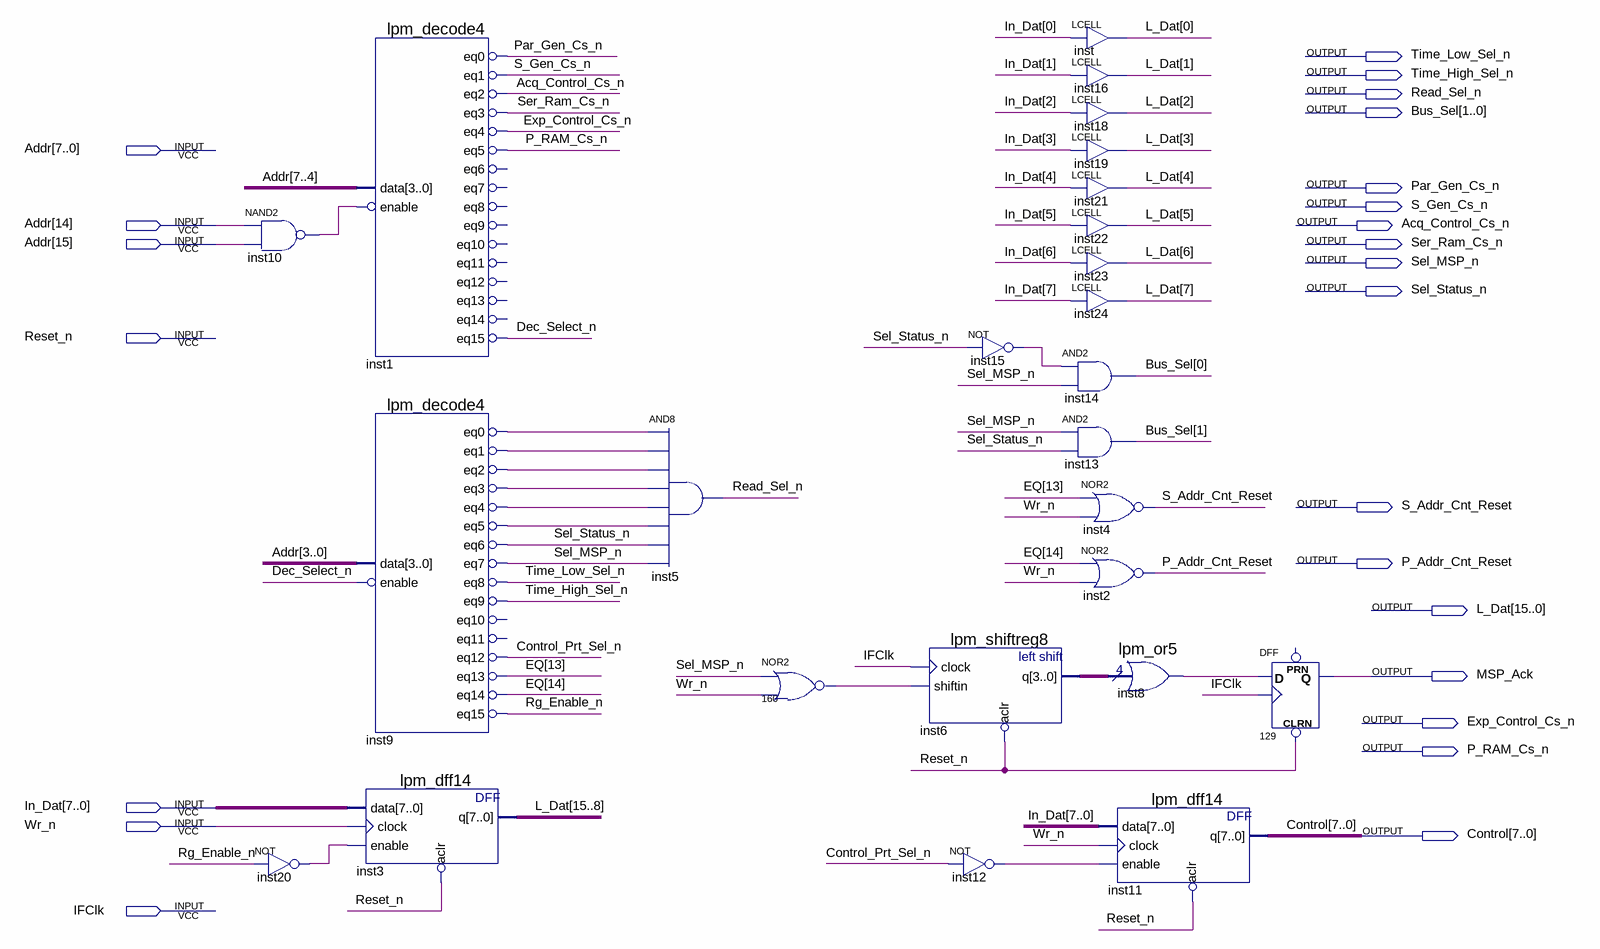
[diagram p0: schematic sheet]
// Quartus schematic I_O_Control_Module.bdf as structural Verilog: 25 symbols, 24 pins
module I_O_Control_Module (
  input  [15:0] Addr,
  input  Reset_n,
  input  [7:0] In_Dat,
  input  Wr_n,
  input  IFClk,
  output Time_Low_Sel_n,
  output Time_High_Sel_n,
  output Read_Sel_n,
  output [1:0] Bus_Sel,
  output Par_Gen_Cs_n,
  output S_Gen_Cs_n,
  output Acq_Control_Cs_n,
  output Ser_Ram_Cs_n,
  output Sel_MSP_n,
  output Sel_Status_n,
  output S_Addr_Cnt_Reset,
  output P_Addr_Cnt_Reset,
  output [15:0] L_Dat,
  output MSP_Ack,
  output Exp_Control_Cs_n,
  output P_RAM_Cs_n,
  output [7:0] Control
);

  wire Control_Prt_Sel_n, Dec_Select_n, inst1_eq0, inst1_eq1, inst1_eq2, inst1_eq3, inst1_eq4, inst1_eq5,
       inst1_eq15, inst8_result, inst9_eq0, inst9_eq0_inverted_out, inst9_eq1, inst9_eq1_inverted_out,
       inst9_eq2, inst9_eq2_inverted_out, inst9_eq3, inst9_eq3_inverted_out, inst9_eq4,
       inst9_eq4_inverted_out, inst9_eq5, inst9_eq5_inverted_out, inst9_eq6, inst9_eq7, inst9_eq8, inst9_eq9,
       inst9_eq12, inst9_eq13, inst9_eq14, inst9_eq15, inst10_out, inst12_out, inst15_out, inst20_out,
       n160_out, Rg_Enable_n;
  wire [3:0] inst6_q;
  wire [14:13] EQ;

  nand inst10 (inst10_out, Addr[14], Addr[15]);
  not inst20 (inst20_out, Rg_Enable_n);
  lpm_decode4 inst1 (
    .data(Addr[7:4]), .enable(~inst10_out), .eq0(inst1_eq0), .eq1(inst1_eq1), .eq2(inst1_eq2),
    .eq3(inst1_eq3), .eq4(inst1_eq4), .eq5(inst1_eq5), .eq15(inst1_eq15));  // open: eq6, eq7, eq8, eq9, eq10, eq11, eq12, eq13, eq14
  not inst1_eq0_inverted (Par_Gen_Cs_n, inst1_eq0);
  not inst1_eq1_inverted (S_Gen_Cs_n, inst1_eq1);
  not inst1_eq2_inverted (Acq_Control_Cs_n, inst1_eq2);
  not inst1_eq3_inverted (Ser_Ram_Cs_n, inst1_eq3);
  not inst1_eq4_inverted (Exp_Control_Cs_n, inst1_eq4);
  not inst1_eq5_inverted (P_RAM_Cs_n, inst1_eq5);
  not inst1_eq15_inverted (Dec_Select_n, inst1_eq15);
  lpm_decode4 inst9 (
    .data(Addr[3:0]), .enable(~Dec_Select_n), .eq0(inst9_eq0), .eq1(inst9_eq1), .eq2(inst9_eq2),
    .eq3(inst9_eq3), .eq4(inst9_eq4), .eq5(inst9_eq5), .eq6(inst9_eq6), .eq7(inst9_eq7), .eq8(inst9_eq8),
    .eq9(inst9_eq9), .eq12(inst9_eq12), .eq13(inst9_eq13), .eq14(inst9_eq14), .eq15(inst9_eq15));  // open: eq10, eq11
  not inst9_eq0_inverted (inst9_eq0_inverted_out, inst9_eq0);
  not inst9_eq1_inverted (inst9_eq1_inverted_out, inst9_eq1);
  not inst9_eq2_inverted (inst9_eq2_inverted_out, inst9_eq2);
  not inst9_eq3_inverted (inst9_eq3_inverted_out, inst9_eq3);
  not inst9_eq4_inverted (inst9_eq4_inverted_out, inst9_eq4);
  not inst9_eq5_inverted (inst9_eq5_inverted_out, inst9_eq5);
  not inst9_eq6_inverted (Sel_Status_n, inst9_eq6);
  not inst9_eq7_inverted (Sel_MSP_n, inst9_eq7);
  not inst9_eq8_inverted (Time_Low_Sel_n, inst9_eq8);
  not inst9_eq9_inverted (Time_High_Sel_n, inst9_eq9);
  not inst9_eq12_inverted (Control_Prt_Sel_n, inst9_eq12);
  not inst9_eq13_inverted (EQ[13], inst9_eq13);
  not inst9_eq14_inverted (EQ[14], inst9_eq14);
  not inst9_eq15_inverted (Rg_Enable_n, inst9_eq15);
  lpm_dff14 inst3 (.data(In_Dat), .clock(Wr_n), .enable(inst20_out), .aclr(~Reset_n), .q(L_Dat[15:8]));
  and inst5 (Read_Sel_n, inst9_eq0_inverted_out, inst9_eq1_inverted_out, inst9_eq2_inverted_out, inst9_eq3_inverted_out, inst9_eq4_inverted_out, inst9_eq5_inverted_out, Sel_Status_n, Sel_MSP_n);
  nor u_160 (n160_out, Sel_MSP_n, Wr_n);
  lpm_shiftreg8 inst6 (.clock(IFClk), .shiftin(n160_out), .aclr(~Reset_n), .q(inst6_q));
  not inst12 (inst12_out, Control_Prt_Sel_n);
  not inst15 (inst15_out, Sel_Status_n);
  LCELL inst (.IN(In_Dat[0]), .OUT(L_Dat[0]));
  LCELL inst16 (.IN(In_Dat[1]), .OUT(L_Dat[1]));
  LCELL inst18 (.IN(In_Dat[2]), .OUT(L_Dat[2]));
  LCELL inst19 (.IN(In_Dat[3]), .OUT(L_Dat[3]));
  LCELL inst21 (.IN(In_Dat[4]), .OUT(L_Dat[4]));
  LCELL inst22 (.IN(In_Dat[5]), .OUT(L_Dat[5]));
  LCELL inst23 (.IN(In_Dat[6]), .OUT(L_Dat[6]));
  LCELL inst24 (.IN(In_Dat[7]), .OUT(L_Dat[7]));
  and inst14 (Bus_Sel[0], inst15_out, Sel_MSP_n);
  and inst13 (Bus_Sel[1], Sel_MSP_n, Sel_Status_n);
  nor inst4 (S_Addr_Cnt_Reset, EQ[13], Wr_n);
  nor inst2 (P_Addr_Cnt_Reset, EQ[14], Wr_n);
  lpm_or5 inst8 (.data(inst6_q), .result(inst8_result));
  lpm_dff14 inst11 (.data(In_Dat), .clock(Wr_n), .enable(inst12_out), .aclr(~Reset_n), .q(Control));
  DFF u_129 (.CLRN(Reset_n), .CLK(IFClk), .D(inst8_result), .Q(MSP_Ack));  // open: PRN
endmodule
